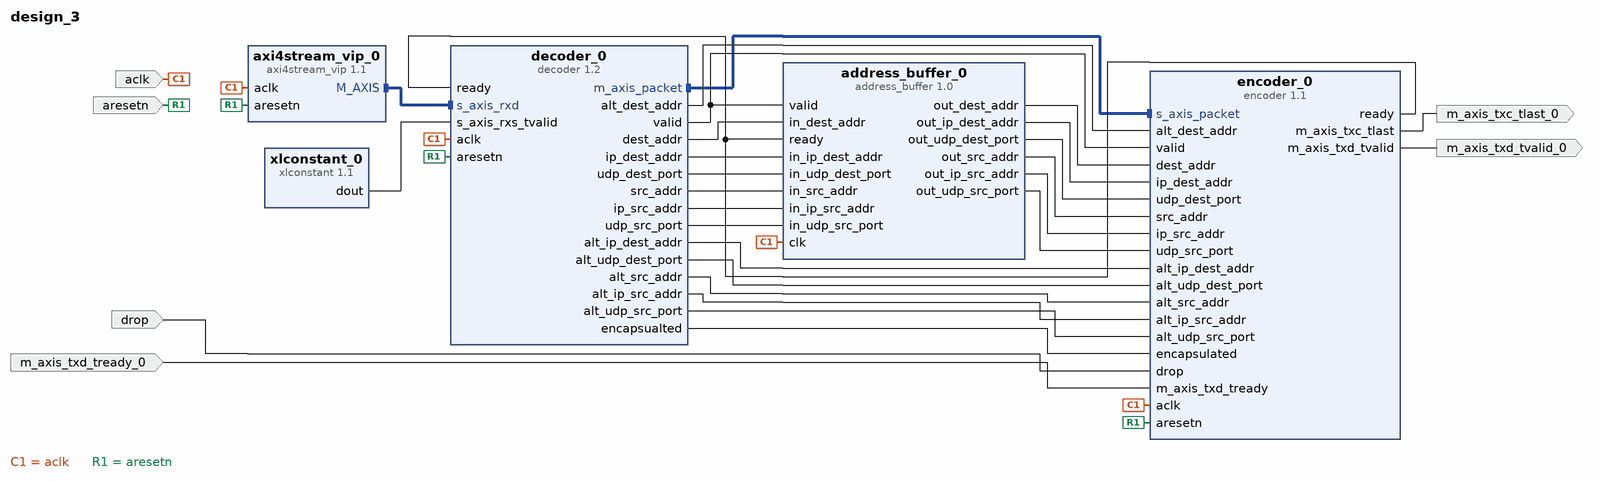
[diagram p0: block diagram of the top level]
# Vivado block design design_3, xc7a200tsbg484-1, Vivado 2018.3.1
create_bd_design design_3

create_bd_port -dir I -type clk aclk
set_property -dict {CONFIG.FREQ_HZ 100000000} [get_bd_ports aclk]
create_bd_port -dir I -type rst aresetn
create_bd_port -dir I drop
create_bd_port -dir I m_axis_txd_tready_0
create_bd_port -dir O m_axis_txc_tlast_0
create_bd_port -dir O m_axis_txd_tvalid_0

create_bd_cell -type ip -vlnv xilinx.com:ip:axi4stream_vip:1.1 axi4stream_vip_0
set_property -dict [list \
  CONFIG.HAS_ACLKEN 0 \
  CONFIG.HAS_TKEEP 1 \
  CONFIG.HAS_TLAST 1 \
  CONFIG.HAS_TREADY 1 \
  CONFIG.HAS_TSTRB 0 \
  CONFIG.INTERFACE_MODE MASTER \
  CONFIG.TDATA_NUM_BYTES 4 \
  CONFIG.TDEST_WIDTH 0 \
  CONFIG.TID_WIDTH 0 \
  CONFIG.TUSER_WIDTH 0 \
] [get_bd_cells axi4stream_vip_0]
create_bd_cell -type ip -vlnv xilinx.com:ip:xlconstant:1.1 xlconstant_0
set_property -dict {CONFIG.CONST_VAL 0} [get_bd_cells xlconstant_0]
create_bd_cell -type ip -vlnv utoronto.ca:user:encoder:1.1 encoder_0
create_bd_cell -type ip -vlnv utoronto.ca:user:decoder:1.2 decoder_0
set_property -dict {CONFIG.NUM_HEADERS 1} [get_bd_cells decoder_0]
create_bd_cell -type ip -vlnv utoronto.ca:user:address_buffer:1.0 address_buffer_0

# ---- connections ----

connect_bd_intf_net [get_bd_intf_pins decoder_0/m_axis_packet] [get_bd_intf_pins encoder_0/s_axis_packet]
connect_bd_intf_net [get_bd_intf_pins axi4stream_vip_0/M_AXIS] [get_bd_intf_pins decoder_0/s_axis_rxd]
connect_bd_net [get_bd_ports aclk] \
  [get_bd_pins axi4stream_vip_0/aclk] [get_bd_pins encoder_0/aclk] [get_bd_pins decoder_0/aclk] \
  [get_bd_pins address_buffer_0/clk]
connect_bd_net -net rst_aclk_100M_peripheral_aresetn [get_bd_ports aresetn] \
  [get_bd_pins axi4stream_vip_0/aresetn] [get_bd_pins encoder_0/aresetn] [get_bd_pins decoder_0/aresetn]
connect_bd_net [get_bd_ports drop] [get_bd_pins encoder_0/drop]
connect_bd_net [get_bd_pins xlconstant_0/dout] [get_bd_pins decoder_0/s_axis_rxs_tvalid]
connect_bd_net -net m_axis_txd_tready_0_1 [get_bd_ports m_axis_txd_tready_0] [get_bd_pins encoder_0/m_axis_txd_tready]
connect_bd_net [get_bd_pins encoder_0/m_axis_txc_tlast] [get_bd_ports m_axis_txc_tlast_0]
connect_bd_net [get_bd_pins encoder_0/m_axis_txd_tvalid] [get_bd_ports m_axis_txd_tvalid_0]
connect_bd_net [get_bd_pins decoder_0/alt_dest_addr] [get_bd_pins encoder_0/alt_dest_addr]
connect_bd_net [get_bd_pins decoder_0/alt_ip_dest_addr] [get_bd_pins encoder_0/alt_ip_dest_addr]
connect_bd_net [get_bd_pins decoder_0/alt_udp_dest_port] [get_bd_pins encoder_0/alt_udp_dest_port]
connect_bd_net [get_bd_pins decoder_0/alt_src_addr] [get_bd_pins encoder_0/alt_src_addr]
connect_bd_net [get_bd_pins decoder_0/alt_ip_src_addr] [get_bd_pins encoder_0/alt_ip_src_addr]
connect_bd_net [get_bd_pins decoder_0/alt_udp_src_port] [get_bd_pins encoder_0/alt_udp_src_port]
connect_bd_net [get_bd_pins decoder_0/encapsualted] [get_bd_pins encoder_0/encapsulated]
connect_bd_net [get_bd_pins decoder_0/valid] [get_bd_pins encoder_0/valid] [get_bd_pins address_buffer_0/valid]
connect_bd_net [get_bd_pins encoder_0/ready] [get_bd_pins decoder_0/ready] [get_bd_pins address_buffer_0/ready]
connect_bd_net [get_bd_pins decoder_0/dest_addr] [get_bd_pins address_buffer_0/in_dest_addr]
connect_bd_net [get_bd_pins decoder_0/ip_dest_addr] [get_bd_pins address_buffer_0/in_ip_dest_addr]
connect_bd_net [get_bd_pins decoder_0/udp_dest_port] [get_bd_pins address_buffer_0/in_udp_dest_port]
connect_bd_net [get_bd_pins decoder_0/src_addr] [get_bd_pins address_buffer_0/in_src_addr]
connect_bd_net [get_bd_pins decoder_0/ip_src_addr] [get_bd_pins address_buffer_0/in_ip_src_addr]
connect_bd_net [get_bd_pins decoder_0/udp_src_port] [get_bd_pins address_buffer_0/in_udp_src_port]
connect_bd_net [get_bd_pins address_buffer_0/out_dest_addr] [get_bd_pins encoder_0/dest_addr]
connect_bd_net [get_bd_pins address_buffer_0/out_ip_dest_addr] [get_bd_pins encoder_0/ip_dest_addr]
connect_bd_net [get_bd_pins address_buffer_0/out_udp_dest_port] [get_bd_pins encoder_0/udp_dest_port]
connect_bd_net [get_bd_pins address_buffer_0/out_src_addr] [get_bd_pins encoder_0/src_addr]
connect_bd_net [get_bd_pins address_buffer_0/out_ip_src_addr] [get_bd_pins encoder_0/ip_src_addr]
connect_bd_net [get_bd_pins address_buffer_0/out_udp_src_port] [get_bd_pins encoder_0/udp_src_port]

validate_bd_design
save_bd_design
